# EAGLE design IRIO (EAGLE 9.6.2)
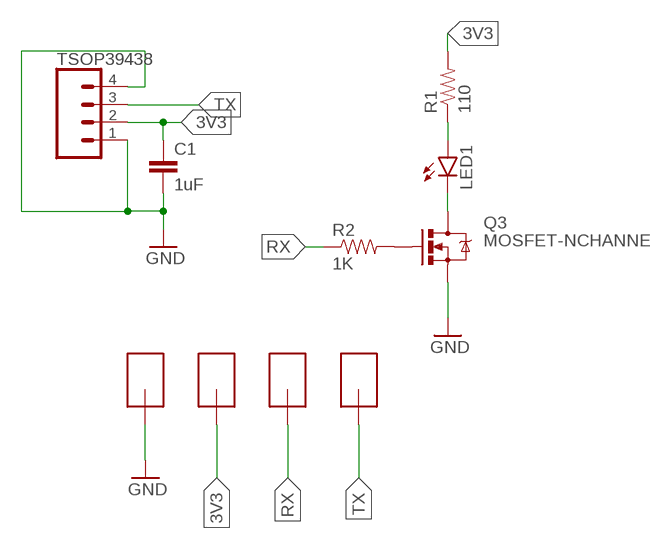
[diagram p0: schematic, sheet 1]

## Parts
C1  1uF  CAP0805  [0805]
LED1  LED5MM  [LED5MM]
Q3  MOSFET-NCHANNEL  MOSFET-NCHANNELAO3404A  [SOT23-3]
R1  110  RESISTOR0805-RES  [0805]
R2  1K  RESISTOR0805-RES  [0805]
TSOP39438  CONN_041.27MM  [1X04_1.27MM]
U$1  SMD-PAD1SMD-PAD80X32  [SMD-PAD6]
U$2  SMD-PAD1SMD-PAD80X32  [SMD-PAD6]
U$3  SMD-PAD1SMD-PAD80X32  [SMD-PAD6]
U$4  SMD-PAD1SMD-PAD80X32  [SMD-PAD6]

## Nets
3V3: C1.1 R1.2 TSOP39438.2 U$3.>PAD
GND: C1.2 Q3.2(S) TSOP39438.1 TSOP39438.4 U$2.>PAD
N$2: LED1.A R1.1
N$3: Q3.1(G) R2.2
N$4: LED1.K(C) Q3.3(D)
RX: R2.1 U$1.>PAD
TX: TSOP39438.3 U$4.>PAD

## Library data of the parts
C1 = SparkFun-Capacitors:CAP: Capacitor Standard 0603 ceramic capacitor, and 0.1" leaded capacitor.
LED1 = led:LED: LED OSRAM: - CHIPLED LG R971, LG N971, LY N971, LG Q971, LY Q971, LO R971, LY R971 LH N974, LH R974 LS Q976, LO Q976, LY Q976 LO Q996 - Hyper CHIPLED LW Q18S LB Q993, LB Q99A, LB R99A - SideLED LS A670, LO A670, LY A670, LG A670, LP A670 LB A673, LV A673, LT A673, LW A673 LH A674 LY A675 LS A676, LA A676, LO A676, LY A676, LW A676 LS A679, LY A679, LG A679 - Hyper Micro SIDELED® LS Y876, LA Y876, LO Y876, LY Y876 LT Y87S - SmartLED LW L88C, LW L88S LB L89C, LB L89S, LG L890 LS L89K, LO L89K, LY L89K LS L896, LA L896, LO L896, LY L896 - TOPLED LS T670, LO T670, LY T670, LG T670, LP T670 LSG T670, LSP T670, LSY T670, LOP T670, LYG T670 LG T671, LOG T671, LSG T671 LB T673, LV T673, LT T673, LW T673 LH T674 LS T676, LA T676, LO T676, LY T676, LB T676, LH T676, LSB T676, LW T676 LB T67C, LV T67C, LT T67C, LS T67K, LO T67K, LY T67K, LW E67C LS E67B, LA E67B, LO E67B, LY E67B, LB E67C, LV E67C, LT E67C LW T67C LS T679, LY T679, LG T679 LS T770, LO T770, LY T770, LG T770, LP T770 LB T773, LV T773, LT T773, LW T773 LH T774 LS E675, LA E675, LY E675, LS T675 LS T776, LA T776, LO T776, LY T776, LB T776 LHGB T686 LT T68C, LB T68C - Hyper Mini TOPLED® LB M676 - Mini TOPLED Santana® LG M470 LS M47K, LO M47K, LY M47K Source: http://www.osram.convergy.de LUXEON: - LUMILED® LXK2-PW12-R00, LXK2-PW12-S00, LXK2-PW14-U00, LXK2-PW14-V00 LXK2-PM12-R00, LXK2-PM12-S00, LXK2-PM14-U00 LXK2-PE12-Q00, LXK2-PE12-R00, LXK2-PE12-S00, LXK2-PE14-T00, LXK2-PE14-U00 LXK2-PB12-K00, LXK2-PB12-L00, LXK2-PB12-M00, LXK2-PB14-N00, LXK2-PB14-P00, LXK2-PB14-Q00 LXK2-PR12-L00, LXK2-PR12-M00, LXK2-PR14-Q00, LXK2-PR14-R00 LXK2-PD12-Q00, LXK2-PD12-R00, LXK2-PD12-S00 LXK2-PH12-R00, LXK2-PH12-S00 LXK2-PL12-P00, LXK2-PL12-Q00, LXK2-PL12-R00 Source: www.luxeon.com KINGBRIGHT: KA-3528ASYC Source: www.kingbright.com
Q3 = SparkFun-DiscreteSemi:MOSFET-NCHANNEL: Common NMOSFET Parts MFG P/N Store ID Prod ID FDD8780 TRANS-09984 SI7820DN TRANS-11055 FDS6630A IC-08089 2N7002PW TRANS-11151 FQP30N06L COM-10213 TRANS-10060 BSS123LT1G TRANS-08345 BSS138 TRANS-00830 BS170 2N7000; PROD_ID: TRAN-12988
R1 R2 = SparkFun-Passives:RESISTOR: Resistor Basic schematic elements and footprints for 0603, 1206, and PTH resistors.
TSOP39438 = SparkFun-Connectors:CONN_04: Multi connection point. Often used as Generic Header-pin footprint for 0.1 inch spaced/style header connections On any of the 0.1 inch spaced packages, you can populate with these: Break Away Headers - Straight <https://www.sparkfun.com/products/116> (PRT-00116) Break Away Male Headers - Right Angle <https://www.sparkfun.com/products/553> (PRT-00553) Female Headers <https://www.sparkfun.com/products/115> (PRT-00115) Break Away Headers - Machine Pin <https://www.sparkfun.com/products/117> (PRT-00117) Break Away Female Headers - Swiss Machine Pin <https://www.sparkfun.com/products/743> (PRT-00743) For SCREWTERMINALS and SPRING TERMINALS visit here: Screw Terimnals on SparkFun.com <https://www.sparkfun.com/search/results?term=Screw+Terminals> (5mm/3.5mm/2.54mm spacing) This device is also useful as a general connection point to wire up your design to another part of your project. Our various solder wires solder well into these plated through hole pads. Hook-Up Wire - Assortment (Stranded, 22 AWG) <https://www.sparkfun.com/products/11375> (PRT-11375) Hook-Up Wire - Assortment (Solid Core, 22 AWG) <https://www.sparkfun.com/products/11367> (PRT-11367) View the entire wire category on our website here <https://www.sparkfun.com/categories/141> Special notes: Molex polarized connector foot print use with SKU : PRT-08231 with associated crimp pins and housings. 1MM SMD Version SKU: PRT-10208
U$1-U$4 = CuriousTech:SMD-PAD1: SMD-PAD small

## Board
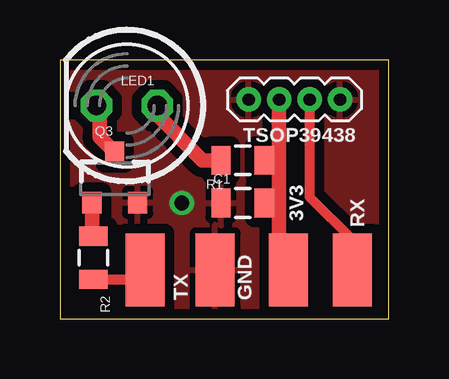
[diagram p1: board, top side]
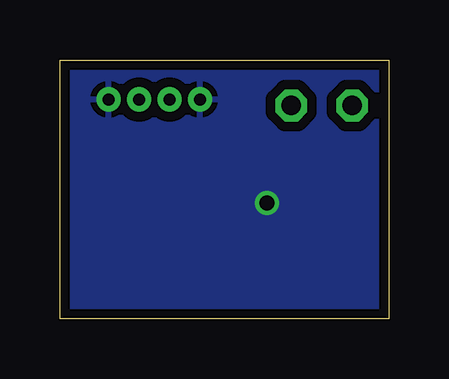
[diagram p2: board, bottom side, seen from below]

Size 13.72 x 10.79 mm. Coordinates in mm from the lower left corner, seen from the top.
Outline: 0,0 13.72,0 13.72,10.79 0,10.79 0,0
Copper layers (1*16): Top 0.035mm / dielectric 1.5mm / Bottom 0.035mm
Design rules "default *": minimum track width 10mil, minimum drill 24mil, track to track 8mil, track to pad 8mil, pad to pad 8mil, via to via 8mil, smd to smd 8mil, copper to edge 15mil, drill to drill 8mil, minimum pad ring 10mil, minimum via ring 8mil, stop-mask expansion 4mil, vias tented up to drill 0mil, thermal gap 10mil

### Footprints (pad centres in the part's own frame; a part is rotated, then mirrored left to right if it is on the bottom)
0805 = smd 0.8 x 1.2: 1 -0.9,0; 2 0.9,0
LED5MM = drill 0.813 octagon: A -1.27,0; K 1.27,0
SOT23-3 = smd 0.8 x 0.9: 1 -0.95,-1; 2 0.95,-1; 3 0,1.1
1X04_1.27MM = drill 0.508 pad 1: 1 0,0; 2 1.27,0; 3 2.54,0; 4 3.81,0
SMD-PAD6 = smd 3.048 x 1.626: >PAD 0,0

### Placement (x,y rotation side)
C1  7.62,4.83 180 top
LED1  2.79,8.89 180 top
Q3  2.29,5.84 0 top
R1  7.62,6.6 0 top
R2  1.4,2.54 90 top
TSOP39438  7.87,9.14 0 top
U$1  3.56,2.03 270 top
U$2  6.48,2.03 90 top
U$3  9.53,2.03 90 top
U$4  12.19,2.03 90 top

### Tracks (layer width: path | path; a pad name or v marks a point on that pad's centre or on a via)
3V3
  Top 0.61: U$3.>PAD 9.02,2.54 9.14,2.67 9.14,5.08 | TSOP39438.2 9.14,6.6 | 9.14,6.6 9.14,5.08 | R1.2 9.14,6.6 | C1.1 8.89,4.83 9.14,5.08
GND  (via drill 0.61)
  other vias: 5.08,4.83
  pour Top (isolate 0.406): 0,0 13.72,0 13.72,10.79 0,10.79
  pour Bottom (isolate 0.406): 0,0 13.72,0 13.72,10.79 0,10.79
N$2
  Top 0.406: 3.93,8.75 3.93,8.64
  Top 0.61: R1.1 5.96,6.6 3.93,8.64 | LED1.A 3.93,8.75
N$3
  Top 0.406: R2.2 1.34,3.74
  Top 0.61: Q3.1 1.34,3.74
N$4
  Top 0.61: Q3.3 1.65,7.58 1.65,8.76 LED1.K
RX
  Top 0.406: R2.1 2.93,1.64 2.94,1.64 3.33,2.03 U$1.>PAD
TX
  Top 0.406: TSOP39438.3 10.41,5.08 12.19,3.3 U$4.>PAD

### Text on the board
tPlace: 3V3 | RX | TX | GND
bStop: CuriousTech.net